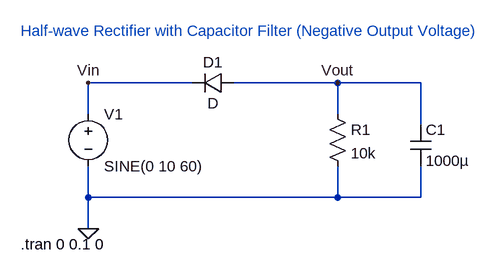
[diagram p0: schematic 2EEB_VELASCO_EXPT3_CKT4.asc]
2EEB_VELASCO_EXPT3_CKT4.asc, the LTspice schematic file:
Version 4
SHEET 1 880 680
WIRE 192 80 32 80
WIRE 416 80 256 80
WIRE 544 80 416 80
WIRE 32 128 32 80
WIRE 416 128 416 80
WIRE 544 144 544 80
WIRE 32 256 32 208
WIRE 416 256 416 208
WIRE 416 256 32 256
WIRE 544 256 544 208
WIRE 544 256 416 256
WIRE 32 304 32 256
FLAG 32 304 0
FLAG 32 80 Vin
FLAG 416 80 Vout
SYMBOL res 400 112 R0
SYMATTR InstName R1
SYMATTR Value 10k
SYMBOL voltage 32 112 R0
WINDOW 123 0 0 Left 0
WINDOW 39 0 0 Left 0
SYMATTR InstName V1
SYMATTR Value SINE(0 10 60)
SYMBOL cap 528 144 R0
SYMATTR InstName C1
SYMATTR Value 1000µ
SYMBOL diode 256 64 R90
WINDOW 0 0 32 VBottom 2
WINDOW 3 32 32 VTop 2
SYMATTR InstName D1
TEXT -72 328 Left 2 !.tran 0 0.1 0
TEXT -72 0 Left 2 ;Half-wave Rectifier with Capacitor Filter (Negative Output Voltage)

The netlist it stands for:
* 2EEB_VELASCO_EXPT3_CKT4.asc
R1 Vout 0 10k
V1 Vin 0 SINE(0 10 60)
C1 Vout 0 1000µ
D1 Vout Vin D
.model D D
.lib standard.dio
.tran 0 0.1 0
* Half-wave Rectifier with Capacitor Filter (Negative Output Voltage)
.backanno
.end